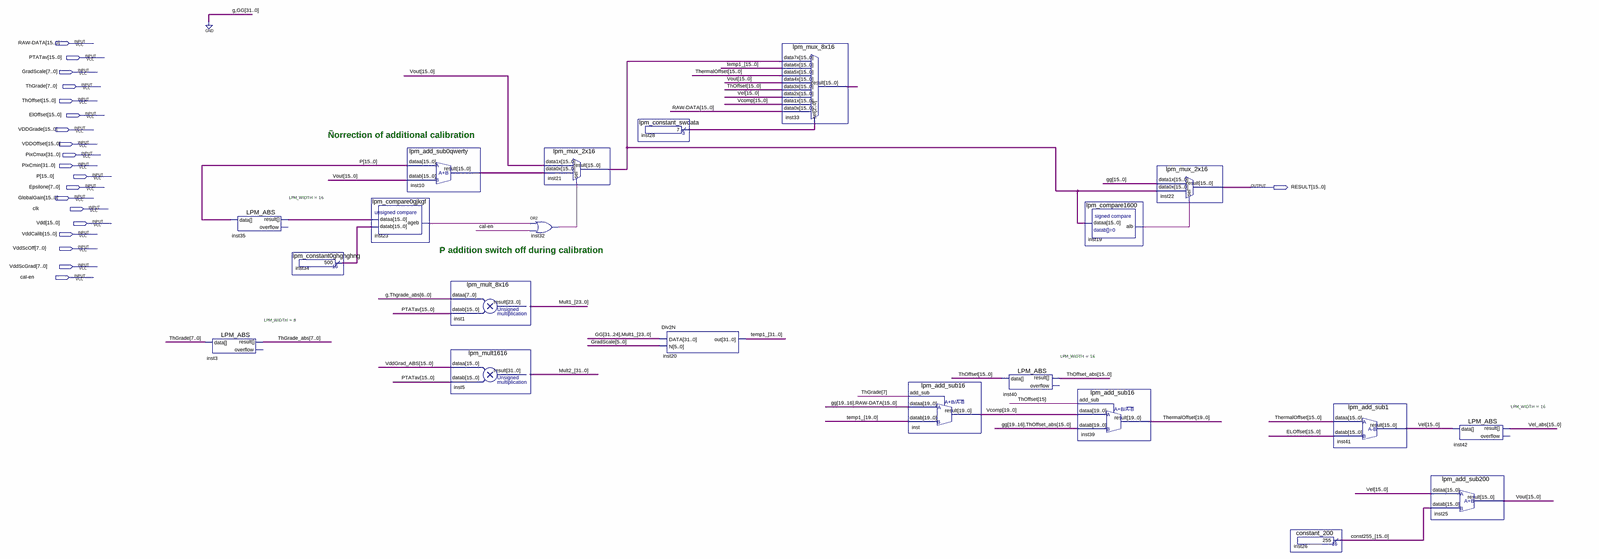
[diagram p0: schematic sheet, whole]
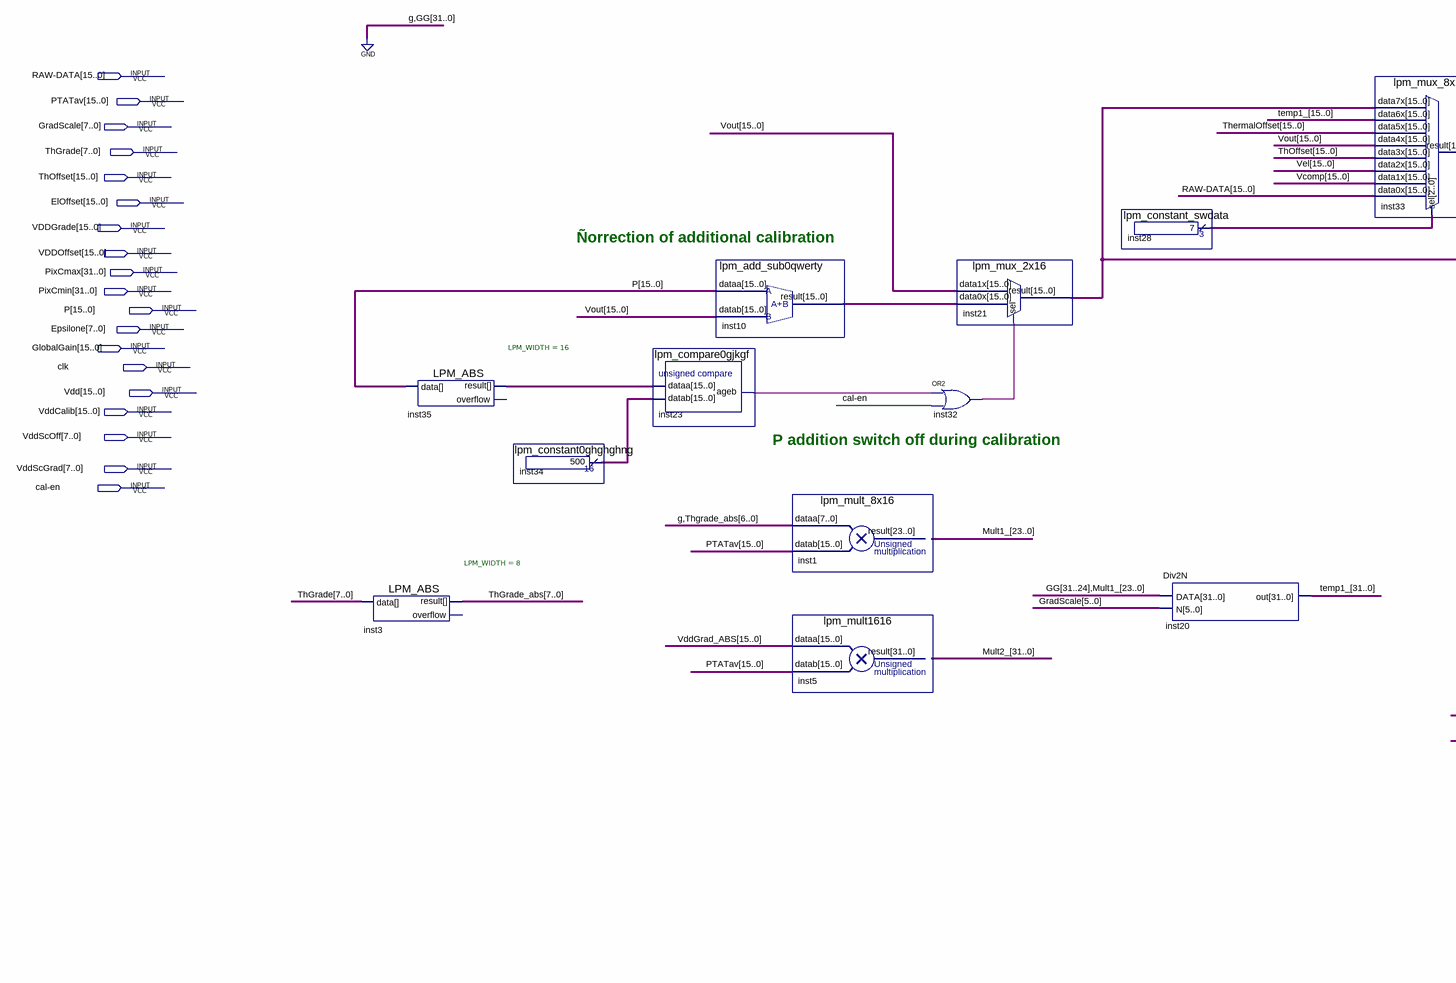
[diagram p1: schematic sheet, left part]
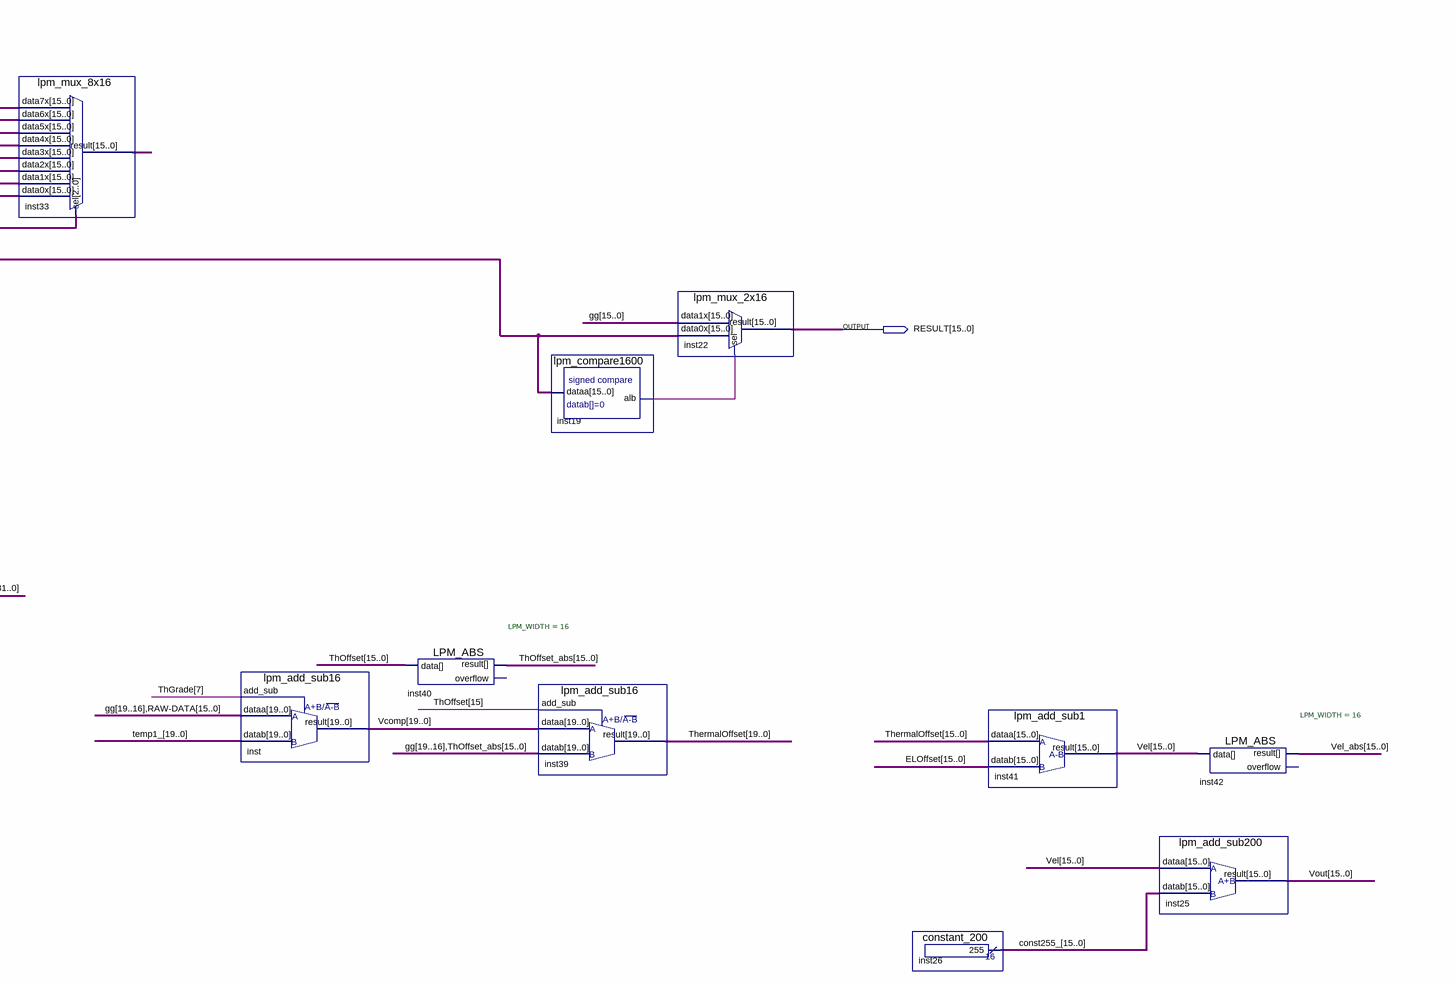
[diagram p2: schematic sheet, right part]
// Quartus schematic Tcalculate_work.bdf as structural Verilog: 21 symbols, 20 pins
module Tcalculate_work (
  input  [15:0] \RAW-DATA ,
  input  [15:0] PTATav,
  input  [7:0] GradScale,
  input  [7:0] ThGrade,
  input  [15:0] ThOffset,
  input  [15:0] ElOffset,
  input  [15:0] VDDGrade,
  input  [15:0] VDDOffset,
  input  [31:0] PixCmax,
  input  [31:0] PixCmin,
  input  [15:0] P,
  input  [7:0] Epsilone,
  input  [15:0] GlobalGain,
  input  clk,
  input  [15:0] Vdd,
  input  [15:0] VddCalib,
  input  [7:0] VddScOff,
  input  [7:0] VddScGrad,
  input  \cal-en ,
  output [15:0] RESULT
);

  wire inst19_alb, inst23_ageb, inst32_out;
  wire [2:0] inst28_result;
  wire [7:0] ThGrade_abs;
  wire [15:0] const255_, inst10_result, inst21_result, inst33_result, inst34_result, inst35_result,
       ThOffset_abs, VddGrad_ABS, Vel, Vel_abs, Vout;
  wire [19:0] ThermalOffset, Vcomp;
  wire [23:0] Mult1_;
  wire [31:0] Mult2_, temp1_;

  LPM_ABS #(.LPM_WIDTH(8)) inst3 (.data(ThGrade), .result(ThGrade_abs));  // open: overflow
  LPM_ABS #(.LPM_WIDTH(16)) inst35 (.data(P), .result(inst35_result));  // open: overflow
  lpm_constant0ghghghng inst34 (.result(inst34_result));
  lpm_compare0gjkgf inst23 (.dataa(inst35_result), .datab(inst34_result), .ageb(inst23_ageb));
  lpm_add_sub0qwerty inst10 (.dataa(P), .datab(Vout), .result(inst10_result));
  lpm_mult_8x16 inst1 (.dataa({1'b0, ThGrade_abs[6:0]}), .datab(PTATav), .result(Mult1_));
  lpm_mult1616 inst5 (.dataa(VddGrad_ABS), .datab(PTATav), .result(Mult2_));
  or inst32 (inst32_out, inst23_ageb, \cal-en );
  lpm_mux_2x16 inst21 (.data1x(Vout), .data0x(inst10_result), .sel(inst32_out), .result(inst21_result));
  lpm_constant_swdata inst28 (.result(inst28_result));
  Div2N inst20 (.DATA({{8{1'b0}}, Mult1_}), .N(GradScale[5:0]), .out(temp1_));
  lpm_mux_8x16 inst33 (
    .data7x(inst21_result), .data6x(temp1_[15:0]), .data5x(ThermalOffset[15:0]), .data4x(Vout),
    .data3x(ThOffset), .data2x(Vel), .data1x(Vcomp[15:0]), .data0x(\RAW-DATA ), .sel(inst28_result),
    .result(inst33_result));
  lpm_add_sub16 inst (.add_sub(ThGrade[7]), .dataa({4'b0000, \RAW-DATA }), .datab(temp1_[19:0]), .result(Vcomp));
  LPM_ABS #(.LPM_WIDTH(16)) inst40 (.data(ThOffset), .result(ThOffset_abs));  // open: overflow
  lpm_add_sub16 inst39 (.add_sub(ThOffset[15]), .dataa(Vcomp), .datab({4'b0000, ThOffset_abs}), .result(ThermalOffset));
  lpm_compare1600 inst19 (.dataa(inst21_result), .alb(inst19_alb));
  lpm_mux_2x16 inst22 (.data1x({16{1'b0}}), .data0x(inst21_result), .sel(inst19_alb), .result(RESULT));
  constant_200 inst26 (.result(const255_));
  lpm_add_sub1 inst41 (.dataa(ThermalOffset[15:0]), .datab(ElOffset), .result(Vel));
  LPM_ABS #(.LPM_WIDTH(16)) inst42 (.data(Vel), .result(Vel_abs));  // open: overflow
  lpm_add_sub200 inst25 (.dataa(Vel), .datab(const255_), .result(Vout));

  // Notes on the sheet:
  //   Ñorrection of additional calibration
  //   P addition switch off during calibration 
endmodule
